# Altium project ESP32MotorTester.PrjPcb
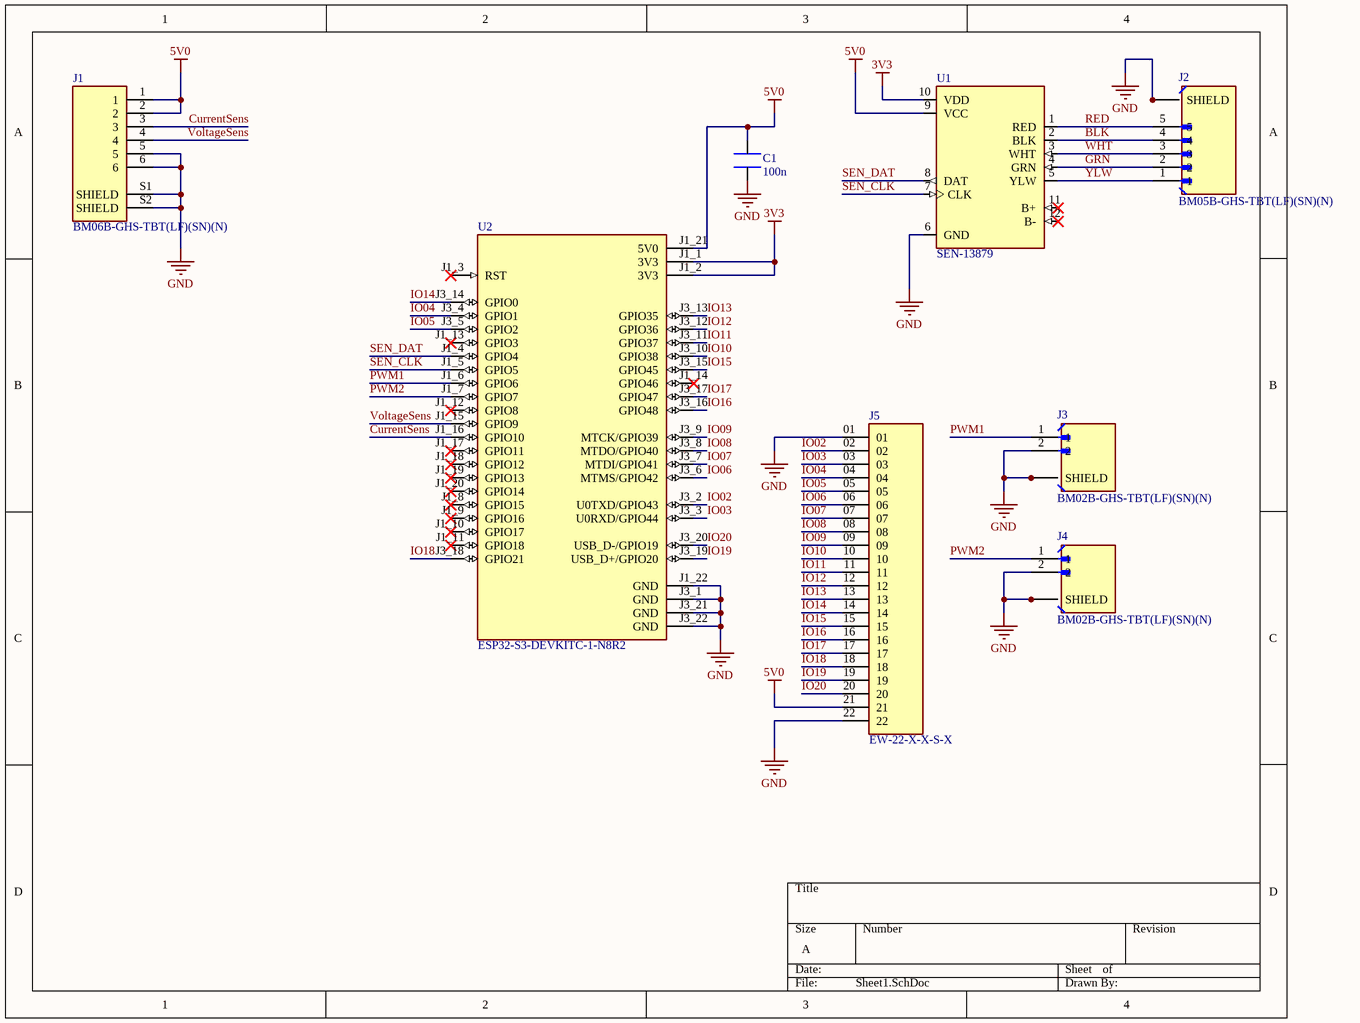
[diagram p0: Sheet1.SchDoc]
1 sheet, 8 parts. Net scope: global (net labels, ports and power ports of the same name join across sheets).
Board file: PCB1.PcbDoc

## Sheet Sheet1.SchDoc
size A; SheetNumber: 1; SheetTotal: 1

### Parts
C1  100n  [WCAP-CSST_885382207007]
J1  BM06B-GHS-TBT(LF)(SN)(N)  [JST_BM06B-GHS-TBT(LF)(SN)(N)]
J2  BM05B-GHS-TBT(LF)(SN)(N)  [JST_BM05B-GHS-TBT(LF)(SN)(N)]
J3  BM02B-GHS-TBT(LF)(SN)(N)  [JST_BM02B-GHS-TBT(LF)(SN)(N)]
J4  BM02B-GHS-TBT(LF)(SN)(N)  [JST_BM02B-GHS-TBT(LF)(SN)(N)]
J5  EW-22-X-X-S-X  [SAMTEC_EW-22-X-X-S-X]
U1  SEN-13879  [SPARKFUN_SEN-13879]
U2  ESP32-S3-DEVKITC-1-N8R2  [XCVR_ESP32-S3-DEVKITC-1-N8R2]

### Nets
3V3: U1.10(VDD) U2.J1_1(3V3) U2.J1_2(3V3)
5V0: C1.2 J1.1 J1.2 J5.21 U1.9(VCC) U2.J1_21(5V0)
GND: C1.1 J1.5 J1.6 J1.S1(SHIELD) J1.S2(SHIELD) J2.S1(SHIELD) J2.S2(SHIELD) J3.2 J3.S1(SHIELD) J3.S2(SHIELD) J4.2 J4.S1(SHIELD) J4.S2(SHIELD) J5.01 J5.22 U1.6(GND) U2.J1_22(GND) U2.J3_1(GND) U2.J3_21(GND) U2.J3_22(GND)
BLK: J2.4 U1.2(BLK)
CurrentSens: J1.3 U2.J1_16(GPIO10)
GRN: J2.2 U1.4(GRN)
IO02: J5.02 U2.J3_2(U0TXD/GPIO43)
IO03: J5.03 U2.J3_3(U0RXD/GPIO44)
IO04: J5.04 U2.J3_4(GPIO1)
IO05: J5.05 U2.J3_5(GPIO2)
IO06: J5.06 U2.J3_6(MTMS/GPIO42)
IO07: J5.07 U2.J3_7(MTDI/GPIO41)
IO08: J5.08 U2.J3_8(MTDO/GPIO40)
IO09: J5.09 U2.J3_9(MTCK/GPIO39)
IO10: J5.10 U2.J3_10(GPIO38)
IO11: J5.11 U2.J3_11(GPIO37)
IO12: J5.12 U2.J3_12(GPIO36)
IO13: J5.13 U2.J3_13(GPIO35)
IO14: J5.14 U2.J3_14(GPIO0)
IO15: J5.15 U2.J3_15(GPIO45)
IO16: J5.16 U2.J3_16(GPIO48)
IO17: J5.17 U2.J3_17(GPIO47)
IO18: J5.18 U2.J3_18(GPIO21)
IO19: J5.19 U2.J3_19(USB_D+/GPIO20)
IO20: J5.20 U2.J3_20(USB_D-/GPIO19)
PWM1: J3.1 U2.J1_6(GPIO6)
PWM2: J4.1 U2.J1_7(GPIO7)
RED: J2.5 U1.1(RED)
SEN_CLK: U1.7(CLK) U2.J1_5(GPIO5)
SEN_DAT: U1.8(DAT) U2.J1_4(GPIO4)
VoltageSens: J1.4 U2.J1_15(GPIO9)
WHT: J2.3 U1.3(WHT)
YLW: J2.1 U1.5(YLW)

Not connected (* = marked no-connect by the designer): U1 11(B+)* 12(B-)*; U2 J1_3(RST)* J1_8(GPIO15)* J1_9(GPIO16)* J1_10(GPIO17)* J1_11(GPIO18)* J1_12(GPIO8)* J1_13(GPIO3)* J1_14(GPIO46)* J1_17(GPIO11)* J1_18(GPIO12)* J1_19(GPIO13)* J1_20(GPIO14)*

### Library data of the parts
C1 = 885382207007: <b> WCAP-CSST Soft Termination MLCC <br> <br> <br><b>Characteristics </b><br> </b><br>Multilayer ceramic chip capacitors <br>Recommended soldering: Reflow <br>Operating temperature: -55 Â°C up to +125 Â°C <br>Capacitance range: 220 pF - 2.2 ÂµF <br>Rated voltage: 16 V(DC) up to 2 kV(DC) <br>Size: 0603, 0805, 1206 and 1210 <br>High absorbtion of mechanical stress   <br> <br> <br><b>Applications </b><br> <br>Application with high mechanical stress <br>Power supply <br>Lighting  <br> <br> <br><a href="https://katalog.we-online.de/media/images/v2/Family_WCAP-CSST.jpg" title="Enlarge picture"> <img src="https://katalog.we-online.de/media/images/v2/Family_WCAP-CSST.jpg" width="320"></a><p> Details see: <a href="https://katalog.we-online.de/en/pbs/WCAP-CSST#vs_ct:1">https://katalog.we-online.de/en/pbs/WCAP-CSST#vs_ct:1<br> <br></a><p>Created By Yingchun,Shan 2018-11-14 <br><br>20178(C) Wurth Elektronik; MF: {'manufacturer': u'Wurth Electronics Inc'}; Package: None; Price: None; Value: *; MP: 885382207007; Availability: Unavailable
J1 = BM06B-GHS-TBT(LF)(SN)(N): Conn Header Gh Top 6pos 1.25mm; MF: {'manufacturer': u'JST Corporation'}; Package: None; Price: None; Value: *; MP: BM06B-GHS-TBT(LF)(SN)(N); Availability: Unavailable
J2 = BM05B-GHS-TBT(LF)(SN)(N): MF: {'manufacturer': u'JST Sales'}; Package: None; Price: None; Value: *; MP: BM05B-GHS-TBT(LF)(SN)(N); Availability: Unavailable
J3 J4 = BM02B-GHS-TBT(LF)(SN)(N): MF: {'manufacturer': u'JST Sales'}; Package: None; Price: None; Value: *; MP: BM02B-GHS-TBT(LF)(SN)(N); Availability: Unavailable
J5 = EW-22-X-X-S-X: MF: {'manufacturer': u'Samtec'}; Package: None; Price: None; Value: *; MP: EW-22-X-X-S-X; Availability: Unavailable
U1 = SEN-13879: Load Cell Amp Hx711; MF: {'manufacturer': u'SparkFun'}; Package: None; Price: None; Value: *; MP: SEN-13879; Availability: Unavailable
U2 = ESP32-S3-DEVKITC-1-N8R2: MF: {'manufacturer': u'Espressif Systems'}; Package: None; Price: None; Value: *; MP: ESP32-S3-DEVKITC-1-N8R2; Availability: Unavailable